# Altium schematic sheet Controller.SchDoc
size A4; SheetNumber: 1; SheetTotal: 4
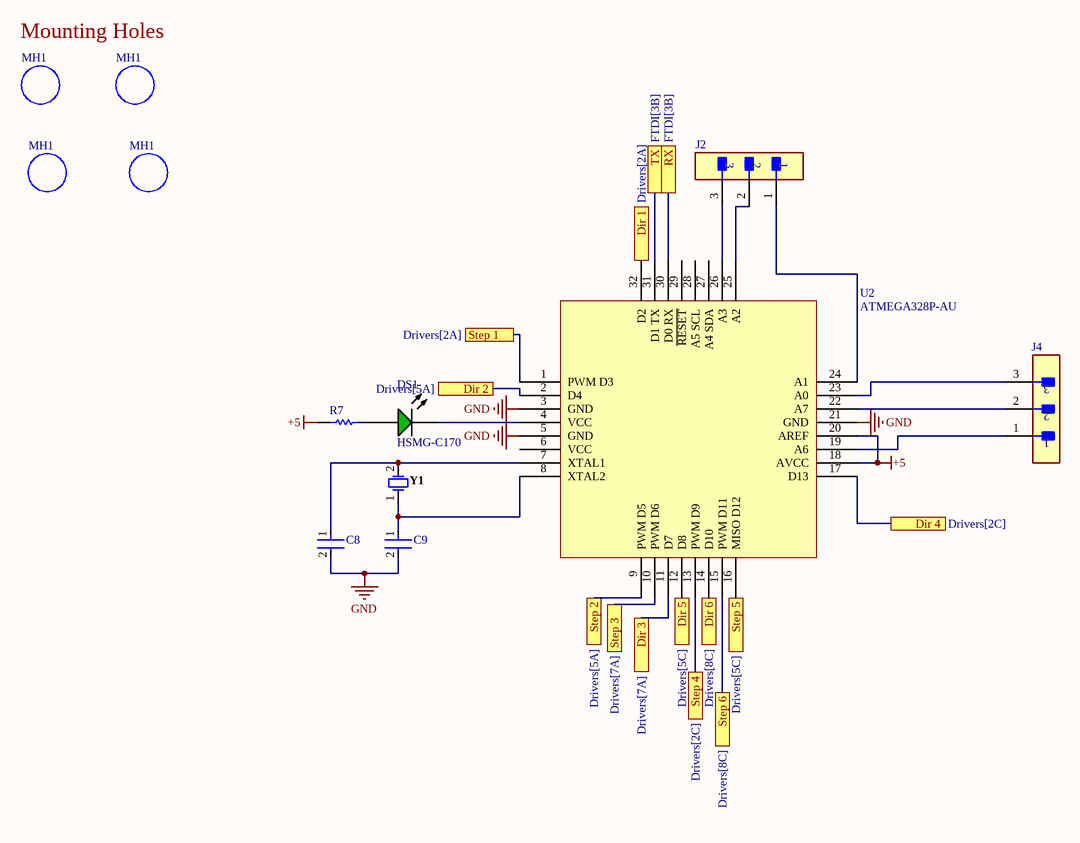
[diagram p0: Controller.SchDoc]

## Parts
(Parts that share a designator on the sheet are numbered #1, #2 ... from top to bottom, then left to right.)
C8  C0603C220J1GACTU  [FP-C0603C-CF-MFG]  (value not drawn)
C9  C0603C220J1GACTU  [FP-C0603C-CF-MFG]  (value not drawn)
DS1  HSMG-C170  [AVAG-HSMX-C170_V]
J2  NRPN031PAEN-RC  [FP-NRPN031PAEN-RC-MFG]  (value not drawn)
J4  NRPN031PAEN-RC  [FP-NRPN031PAEN-RC-MFG]  (value not drawn)
MH1#1  Mounting Hole_1  [Mounting Hole_1]  (value not drawn)
MH1#2  Mounting Hole_1  [Mounting Hole_1]  (value not drawn)
MH1#3  Mounting Hole_1  [Mounting Hole_1]  (value not drawn)
MH1#4  Mounting Hole_1  [Mounting Hole_1]  (value not drawn)
R7  CRCW0402220KFKED  [RESC1005X40X25LL05T05]  (value not drawn)
U2  ATMEGA328P-AU  [TQFP80P900X900X120-32N]
Y1  FOXSLF/160-20  [FOX-FOXSLF160-20]  (value not drawn)

## Ports
Dir 1 (see Drivers[2A]), Dir 2 (see Drivers[5A]), Dir 3 (see Drivers[7A]), Dir 4 (see Drivers[2C]), Dir 5 (see Drivers[5C]), Dir 6 (see Drivers[8C]), RX (see FTDI[3B]), Step 1 (see Drivers[2A]), Step 2 (see Drivers[5A]), Step 3 (see Drivers[7A]), Step 4 (see Drivers[2C]), Step 5 (see Drivers[5C]), Step 6 (see Drivers[8C]), TX (see FTDI[3B])

## Nets
+5: R7.1 U2.18(AVCC) U2.20(AREF)
GND: C8.2 C9.2 U2.3(GND) U2.5(GND) U2.21(GND)
Dir 1: U2.32(D2) ; port Dir 1
Dir 2: U2.2(D4) ; port Dir 2
Dir 3: U2.11(D7) ; port Dir 3
Dir 4: U2.17(D13) ; port Dir 4
Dir 5: U2.12(D8) ; port Dir 5
Dir 6: U2.14(D10) ; port Dir 6
RX: U2.30(D0_RX) ; port RX
Step 1: U2.1(PWM_D3) ; port Step 1
Step 2: U2.9(PWM_D5) ; port Step 2
Step 3: U2.10(PWM_D6) ; port Step 3
Step 4: U2.13(PWM_D9) ; port Step 4
Step 5: U2.16(MISO_D12) ; port Step 5
Step 6: U2.15(PWM_D11) ; port Step 6
TX: U2.31(D1_TX) ; port TX
NetC8_1: C8.1 U2.7(XTAL1) Y1.2
NetC9_1: C9.1 U2.8(XTAL2) Y1.1
NetDS1_1: DS1.1(A) R7.2
NetDS1_2: DS1.2(K) U2.4(VCC)
NetJ2_1: J2.1 U2.24(A1)
NetJ2_2: J2.2 U2.25(A2)
NetJ2_3: J2.3 U2.26(A3)
NetJ4_1: J4.1 U2.19(A6)
NetJ4_2: J4.2 U2.22(A7)
NetJ4_3: J4.3 U2.23(A0)

Not connected (* = marked no-connect by the designer): U2 6(VCC) 27(A4_SDA) 28(A5_SCL) 29(~{RESET})

## Notes on the sheet
- (near MH1#1) Mounting Holes

## Library data of the parts
C8 C9 = CMP-2006-03322-2: CAP CER 22PF 100V 5% NP0 0603; Manufacturer: KEMET; Material: Ceramic; Automotive Grade: Grade 1; Temperature Characteristic: C0G; Temperature Coefficient: 30ppm/°C; Tolerance: 0.05; Temperature Range High: +125°C; Capacitance: 22 pF; ComponentLink2URL: https://api.kemet.com/component-edge/download/datasheet/C0603C100J5GACAUTO.pdf; Package: C0603C-CF; Category: Cap; Voltage Rating: 100 V; Automotive: Yes; Mouser Description: Multilayer Ceramic Capacitors MLCC - SMD/SMT 100volts 22pF C0G 5%; Device Class L1: Passive Components; Device Class L3: Ceramic Capacitors; Temperature: -55°C to +125°C; Digikey Description: CAP CER 22PF 100V 5% NP0 0603; RoHS: TRUE; Value: 22 pF; ComponentLink2Description: Datasheet; Height: 0.87mm; Temperature Range Low: -55°C; Manufacturer Part Number: C0603C220J1GACTU; Device Class L2: Capacitors; Octopart: https://octopart.com/c0603c220j1gactu-kemet-9142653; Lead Free: Yes
DS1 = CMP-2000-05062-1: Chip LED, Green, 2.2 V, -40 to 85 degC, 2-Pin SMD, Pb-Free, Tape and Reel; Manufacturer: Avago; No. of Pins: 2; Peak Wavelength: 570nm; SVHC: NoSVHC(16-Jun-2014); Dominant Wavelength: 572nm; Forward Current If: 20mA; Viewing Angle: 170deg; Lens Shape: Rectangular; PIV Max: 5V; External Width: 1.25mm; LED Type: Standard; External Depth: 0.8mm; Opto Mounting Orientation: Top; Luminous Intensity: 15mcd; Luminous Intensity Min: 4mcd; Forward Voltage VF Max: 2.6V; External Length / Height: 2mm; Bulb Size: 1.25mmx1.4mm; Light Area Height: 1mm; Voltage Vf Typ: 2.2V; Operating Temperature Max: 85degC; Datasheet Version: Oct-08; MSL: MSL2A-4weeks; Peak Forward Current: 20mA; Package Description: 2-Pin Surface Mount Device, Body 2 x 1.25 mm, Height 0.8 mm; Datasheet URL: https://datasheet.ciiva.com/29280/180495-da-01-en-chip-led-hsmg-c170-gelb-gruen-29280971.pdf; Storage Temperature Min: -40degC; LED Colour: Green; Wavelength Typ: 570nm; Mounting Type: SMD; Forward Current If Max: 20mA; Dominant Wavelength Typ: 572nm; LED Mounting: SMD; Operating Temperature Range: -30degCto+85degC; Operating Temperature Min: -30degC; Manufacturer URL: http://www.avagotech.com/; Packaging: CutTape; Luminous Intensity Typ: 15mcd; Package Reference: HSMX-C170; Storage Temperature Max: 85degC; Opto Case Style: SMD; Forward Voltage: 2.2V
J2 J4 = CMP-25680-000021-1: CONN HEADER VERT 3POS 2MM; Manufacturer: Sullins; Number Of Contacts: 3; Conn Orientation: Straight; Voltage Rating: 150V; Conn Gender: Male; Current Rating: 2A; Temperature Range High: +105°C; Category: Conn; Manufacturer Part Number: NRPN031PAEN-RC; RoHS: TRUE; Contact Material: Gold,Nickel; ComponentLink2URL: https://drawings-pdf.s3.amazonaws.com/10531.pdf; Temperature: -40°C to +105°C; Lead Free: Yes; Octopart: https://octopart.com/nrpn031paen-rc-sullins-12817732; ComponentLink2Description: Datasheet; Pitch: 2mm; Number Of Rows: 1; Automotive: No; Height: 6mm; Device Class L2: Headers and Wire Housings; Digikey Description: CONN HEADER VERT 3POS 2MM; Package: 0; Device Class L3: unset; Temperature Range Low: -40°C; Device Class L1: Connectors
R7 = CMP-2002-08370-1: Manufacturer: Vishay Dale; Part Number: CRCW0402220KFKED
U2 = ATMEGA328P-AU: AVR AVR® ATmega Microcontroller IC 8-Bit 20MHz 32KB (16K x 16) FLASH 32-TQFP (7x7); ComponentLink1Description: Digi-Key; ComponentLink1URL: https://www.digikey.ca/en/products/detail/microchip-technology/ATMEGA328P-AU/1832260; Created By: Mostafa H; Date Created: 2023-08-19; Digi-Key Part Number: ATMEGA328P-AU-ND; ComponentLink2Description: Datasheet; ComponentLink2URL: https://ww1.microchip.com/downloads/aemDocuments/documents/MCU08/ProductDocuments/DataSheets/ATmega48A-PA-88A-PA-168A-PA-328-P-DS-DS40002061B.pdf
Y1 = CMP-1749-00003-1: Resistance Weld Thru-Hole Crystal, 16 MHz, -20 to 70 degC, 2-Pin THD, RoHS, Bulk; Voltage Rating: 250 V; Tolerance: 1%; Resistance: 221 kohm; Case\Package: Axial; Power Rating: 250 mW; RoHSCompliant: true; Package Quantity: 200; Packaging: Bulk; Min Operating Temperature: -55 degC; DatasheetVersion: Mar-15; ComponentLink1URL: http://www.foxonline.com/; Max Operating Temperature: 155 degC; PackageReference: FOXSLF160-20; Mount: Through Hole; PackageDescription: 2-Pin Through Hole Device, Body 11.35 x 4.65 mm; ComponentLink1Description: Manufacturer URL; ComponentLink2URL: http://www.foxonline.com/pdfs/hc49slf.pdf; ComponentLink2Description: Datasheet; Length: 0.248 inch